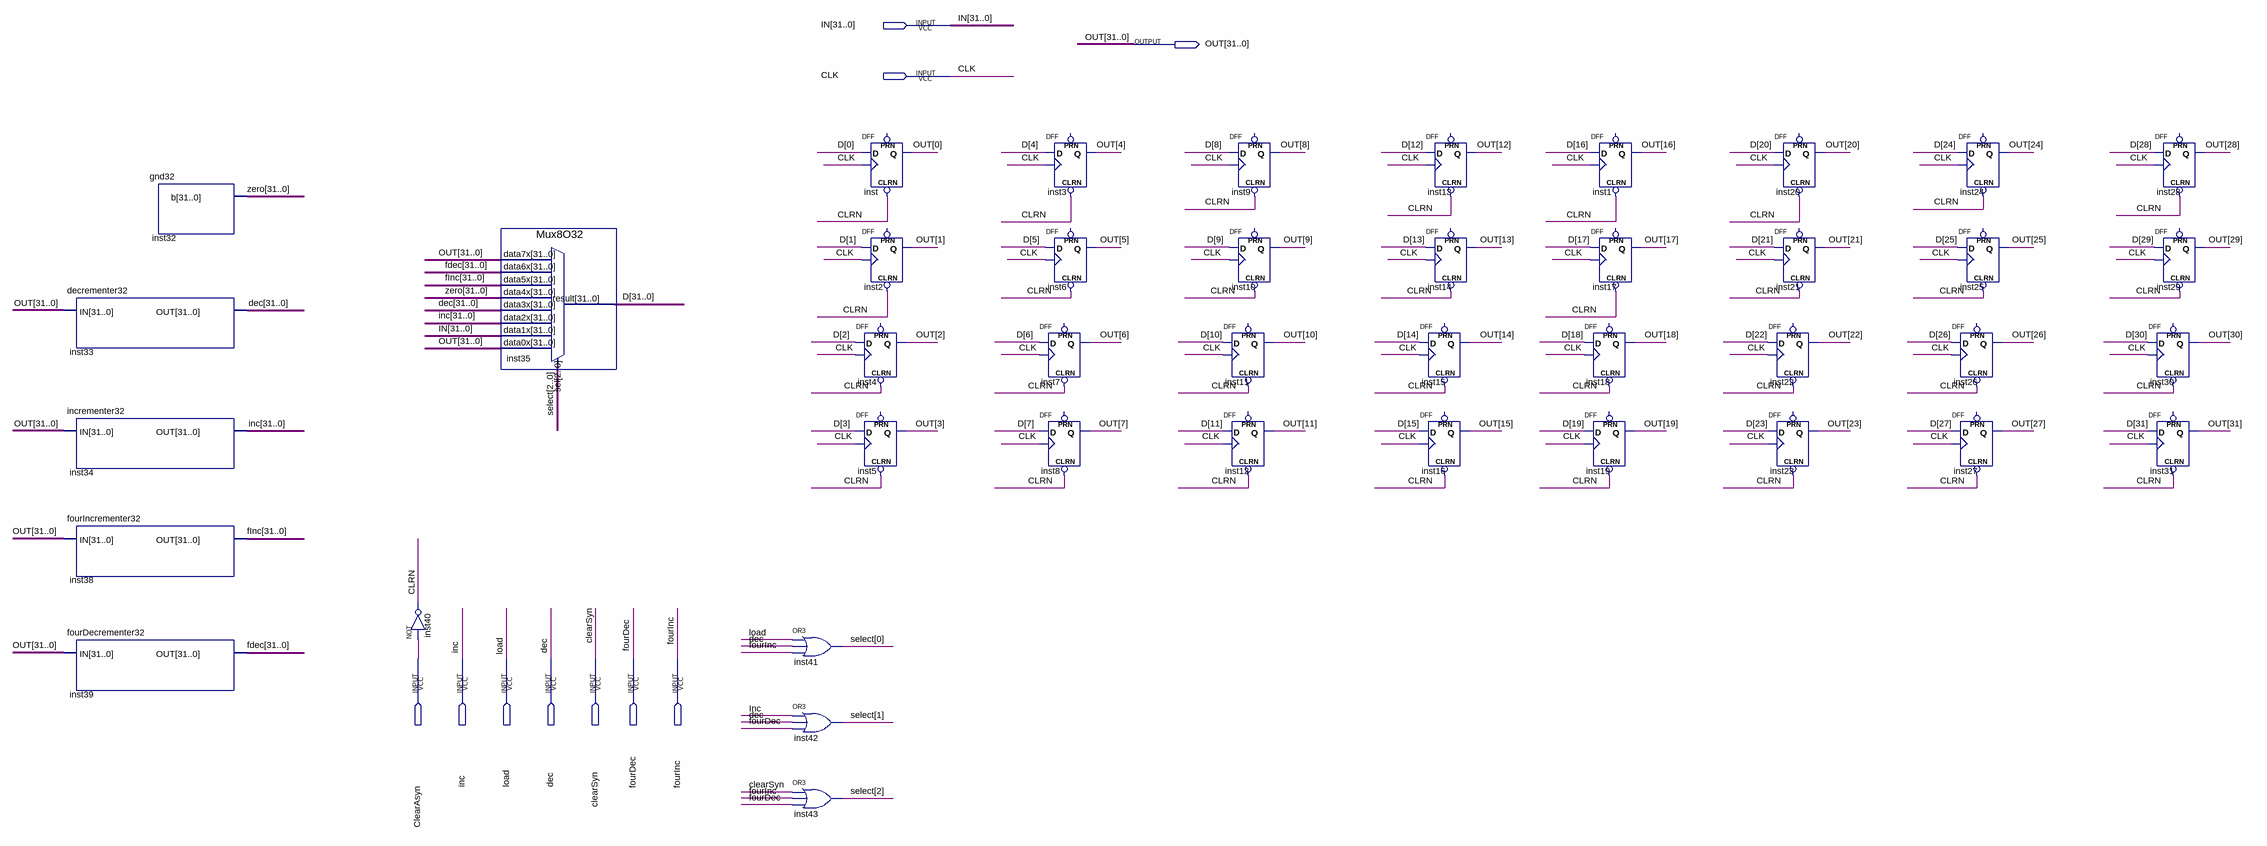
[diagram p0: schematic sheet]
// Quartus schematic Register32.bdf as structural Verilog: 42 symbols, 10 pins
module Register32 (
  input  [31:0] IN,
  input  CLK,
  input  ClearAsyn,
  input  inc,
  input  load,
  input  dec,
  input  clearSyn,
  input  fourDec,
  input  fourInc,
  output [31:0] OUT
);

  wire CLRN;
  wire [2:0] select;
  wire [31:0] D, dec_bus, fdec, fInc, inc_bus, zero;

  decrementer32 inst33 (.IN(OUT), .OUT(dec_bus));
  incrementer32 inst34 (.IN(OUT), .OUT(inc_bus));
  fourIncrementer32 inst38 (.IN(OUT), .OUT(fInc));
  fourDecrementer32 inst39 (.IN(OUT), .OUT(fdec));
  gnd32 inst32 (.b(zero));
  not inst40 (CLRN, ClearAsyn);
  Mux8O32 inst35 (
    .data7x(OUT), .data6x(fdec), .data5x(fInc), .data4x(zero), .data3x(dec_bus), .data2x(inc_bus),
    .data1x(IN), .data0x(OUT), .sel(select), .result(D));
  or inst41 (select[0], load, dec, fourInc);
  or inst42 (select[1], inc, dec, fourDec);
  or inst43 (select[2], clearSyn, fourInc, fourDec);
  DFF inst (.CLRN(CLRN), .CLK(CLK), .D(D[0]), .Q(OUT[0]));  // open: PRN
  DFF inst2 (.CLRN(CLRN), .CLK(CLK), .D(D[1]), .Q(OUT[1]));  // open: PRN
  DFF inst4 (.CLRN(CLRN), .CLK(CLK), .D(D[2]), .Q(OUT[2]));  // open: PRN
  DFF inst5 (.CLRN(CLRN), .CLK(CLK), .D(D[3]), .Q(OUT[3]));  // open: PRN
  DFF inst3 (.CLRN(CLRN), .CLK(CLK), .D(D[4]), .Q(OUT[4]));  // open: PRN
  DFF inst6 (.CLRN(CLRN), .CLK(CLK), .D(D[5]), .Q(OUT[5]));  // open: PRN
  DFF inst7 (.CLRN(CLRN), .CLK(CLK), .D(D[6]), .Q(OUT[6]));  // open: PRN
  DFF inst8 (.CLRN(CLRN), .CLK(CLK), .D(D[7]), .Q(OUT[7]));  // open: PRN
  DFF inst9 (.CLRN(CLRN), .CLK(CLK), .D(D[8]), .Q(OUT[8]));  // open: PRN
  DFF inst10 (.CLRN(CLRN), .CLK(CLK), .D(D[9]), .Q(OUT[9]));  // open: PRN
  DFF inst11 (.CLRN(CLRN), .CLK(CLK), .D(D[10]), .Q(OUT[10]));  // open: PRN
  DFF inst12 (.CLRN(CLRN), .CLK(CLK), .D(D[11]), .Q(OUT[11]));  // open: PRN
  DFF inst13 (.CLRN(CLRN), .CLK(CLK), .D(D[12]), .Q(OUT[12]));  // open: PRN
  DFF inst14 (.CLRN(CLRN), .CLK(CLK), .D(D[13]), .Q(OUT[13]));  // open: PRN
  DFF inst15 (.CLRN(CLRN), .CLK(CLK), .D(D[14]), .Q(OUT[14]));  // open: PRN
  DFF inst16 (.CLRN(CLRN), .CLK(CLK), .D(D[15]), .Q(OUT[15]));  // open: PRN
  DFF inst1 (.CLRN(CLRN), .CLK(CLK), .D(D[16]), .Q(OUT[16]));  // open: PRN
  DFF inst17 (.CLRN(CLRN), .CLK(CLK), .D(D[17]), .Q(OUT[17]));  // open: PRN
  DFF inst18 (.CLRN(CLRN), .CLK(CLK), .D(D[18]), .Q(OUT[18]));  // open: PRN
  DFF inst19 (.CLRN(CLRN), .CLK(CLK), .D(D[19]), .Q(OUT[19]));  // open: PRN
  DFF inst20 (.CLRN(CLRN), .CLK(CLK), .D(D[20]), .Q(OUT[20]));  // open: PRN
  DFF inst21 (.CLRN(CLRN), .CLK(CLK), .D(D[21]), .Q(OUT[21]));  // open: PRN
  DFF inst22 (.CLRN(CLRN), .CLK(CLK), .D(D[22]), .Q(OUT[22]));  // open: PRN
  DFF inst23 (.CLRN(CLRN), .CLK(CLK), .D(D[23]), .Q(OUT[23]));  // open: PRN
  DFF inst24 (.CLRN(CLRN), .CLK(CLK), .D(D[24]), .Q(OUT[24]));  // open: PRN
  DFF inst25 (.CLRN(CLRN), .CLK(CLK), .D(D[25]), .Q(OUT[25]));  // open: PRN
  DFF inst26 (.CLRN(CLRN), .CLK(CLK), .D(D[26]), .Q(OUT[26]));  // open: PRN
  DFF inst27 (.CLRN(CLRN), .CLK(CLK), .D(D[27]), .Q(OUT[27]));  // open: PRN
  DFF inst30 (.CLRN(CLRN), .CLK(CLK), .D(D[30]), .Q(OUT[30]));  // open: PRN
  DFF inst31 (.CLRN(CLRN), .CLK(CLK), .D(D[31]), .Q(OUT[31]));  // open: PRN
  DFF inst28 (.CLRN(CLRN), .CLK(CLK), .D(D[28]), .Q(OUT[28]));  // open: PRN
  DFF inst29 (.CLRN(CLRN), .CLK(CLK), .D(D[29]), .Q(OUT[29]));  // open: PRN
endmodule
